# Altium project BW1098OBC_R1M0E1.PrjPcb
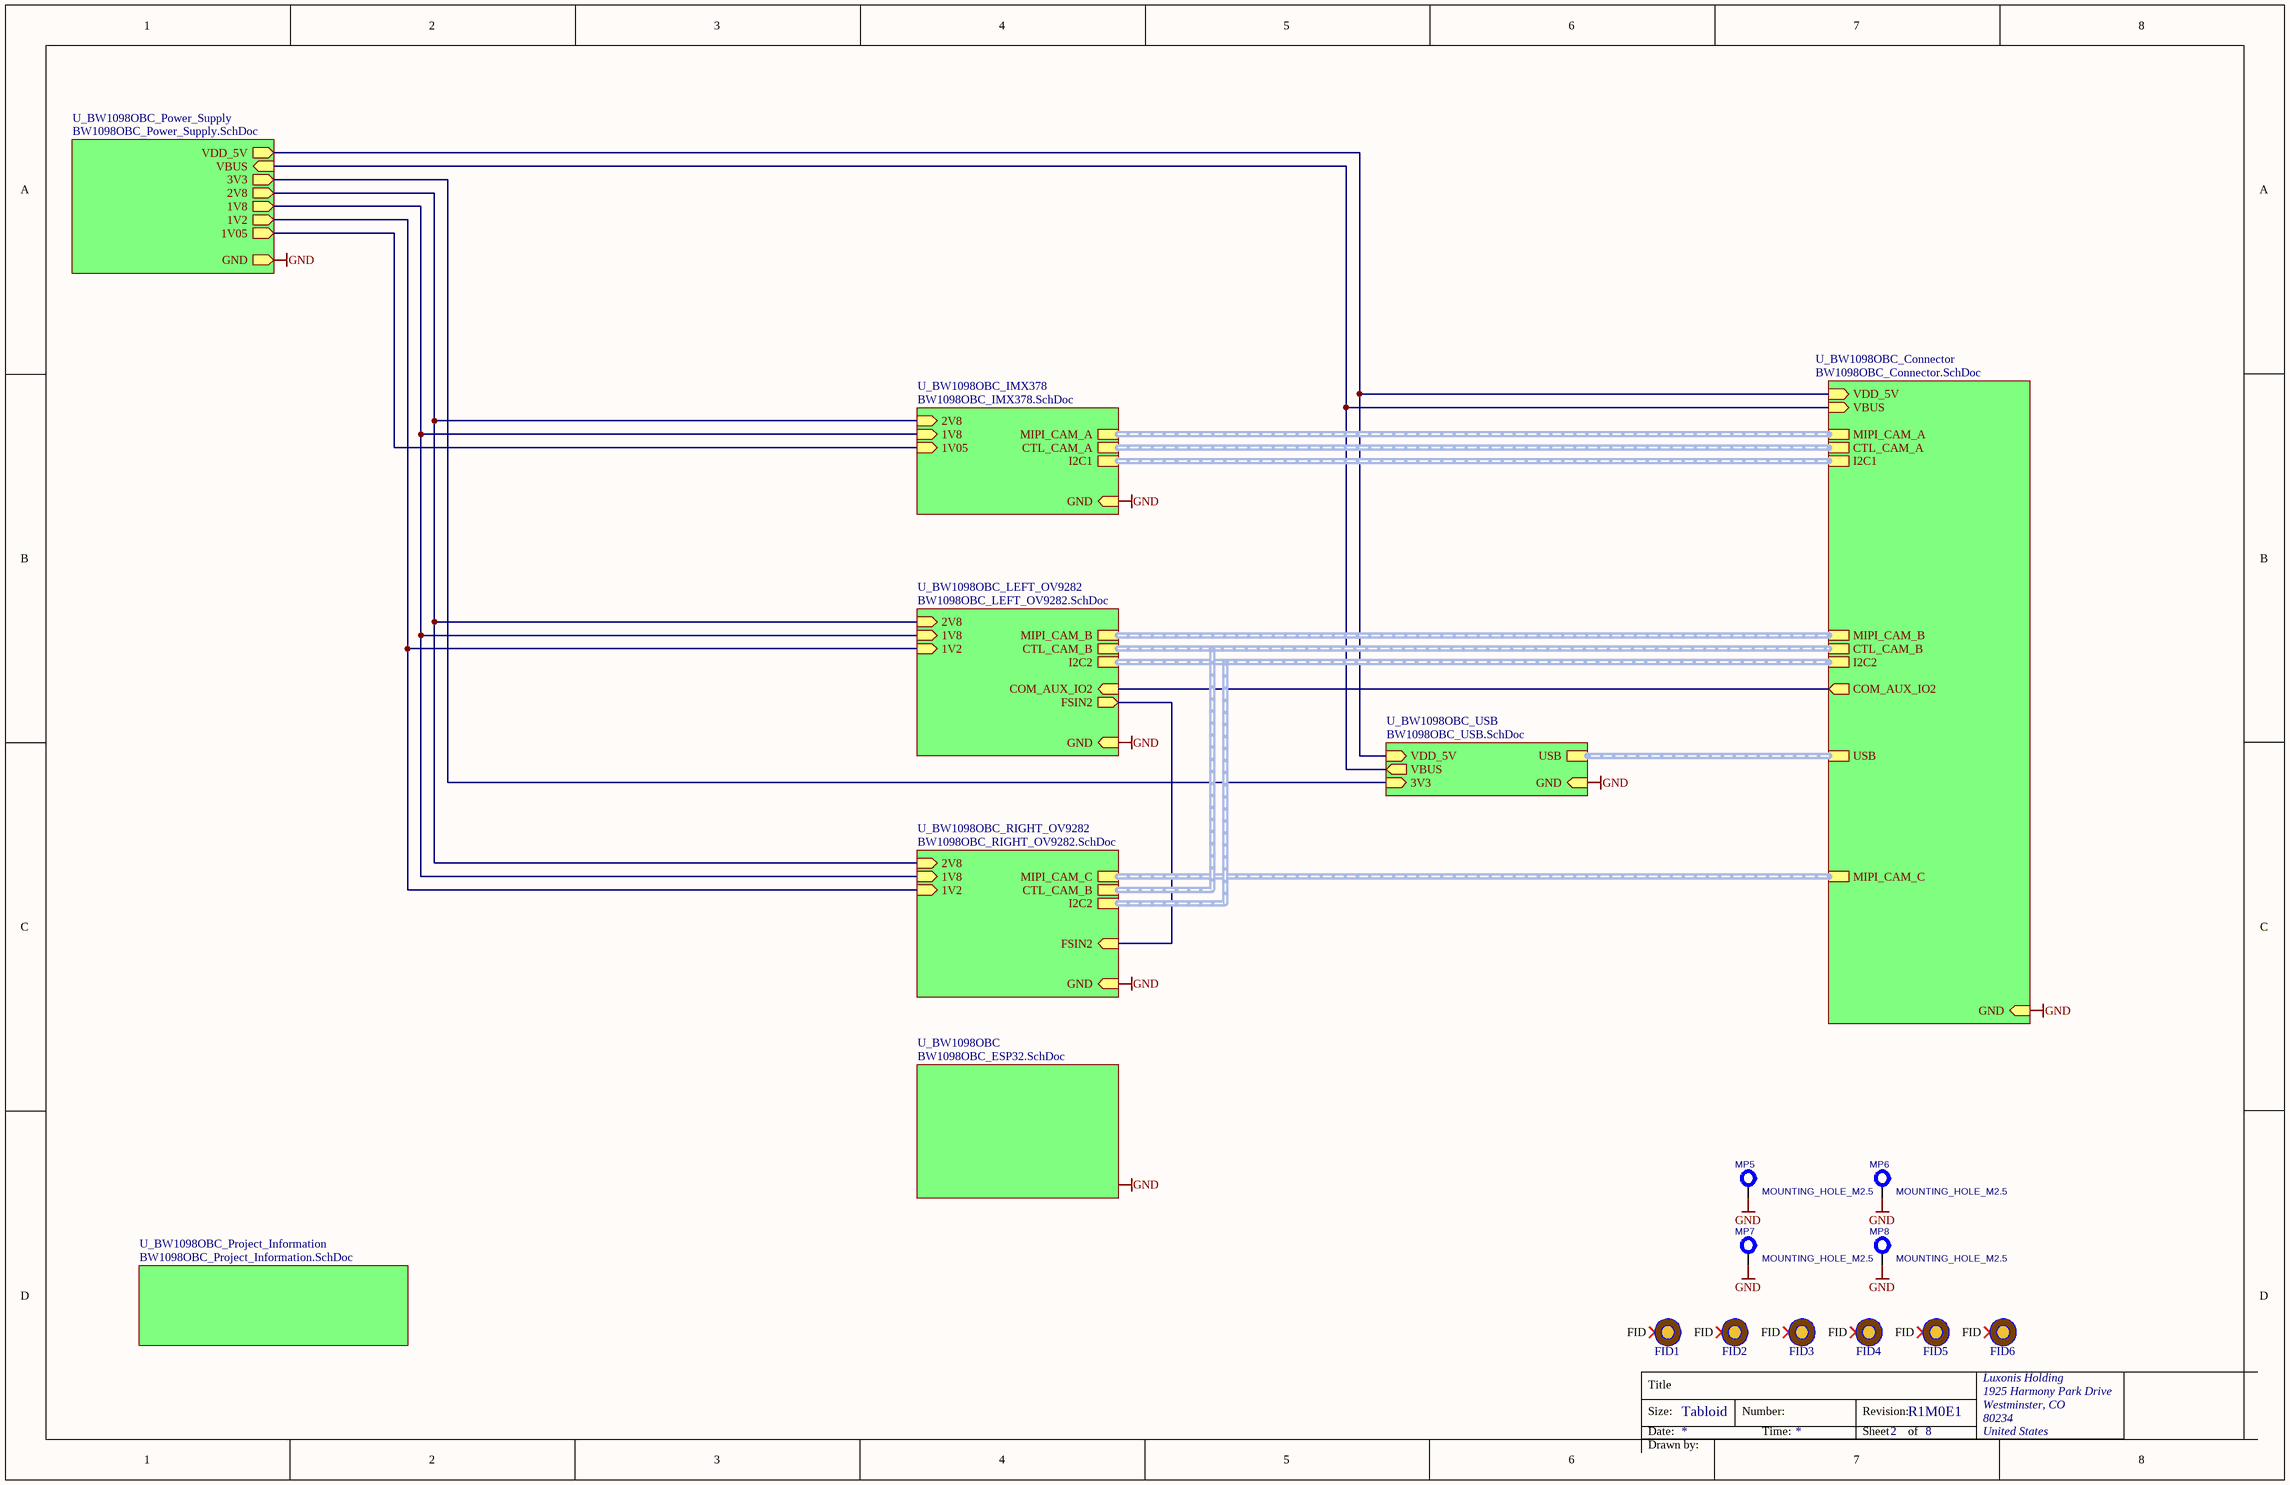
[diagram p0: BW1098OBC_TopLevel.SchDoc]
document_number: DXXXX; drawn_by: Brian Weinstein; project_title: BW1098OBC; revision: R1M0E1
2 sheets, 12 parts. Net scope: strictly hierarchical (ports join the sheet entries above them; power ports are local).
Board file: BW1098OBC.PcbDoc
Sheets:
  BW1098OBC_TopLevel.SchDoc
    U_BW1098OBC = BW1098OBC_ESP32.SchDoc

## Sheet BW1098OBC_TopLevel.SchDoc: =project_title
size Tabloid; CompanyName: Luxonis Holding; DrawnBy: Brian Weinstein; Organization: Luxonis Holding; Address1: 1925 Harmony Park Drive; Address2: Westminster, CO; Address3: 80234; Address4: United States; DocumentNumber: DXXXX; Revision: R1M0E1; SheetNumber: 2; SheetTotal: 8

### Parts
FID1  FIDUCIAL_ROUND_1MM  [FIDUCIAL_ROUND_1MM]  (value not drawn)  (no BOM)
FID2  FIDUCIAL_ROUND_1MM  [FIDUCIAL_ROUND_1MM]  (value not drawn)  (no BOM)
FID3  FIDUCIAL_ROUND_1MM  [FIDUCIAL_ROUND_1MM]  (value not drawn)  (no BOM)
FID4  FIDUCIAL_ROUND_1MM  [FIDUCIAL_ROUND_1MM]  (value not drawn)  (no BOM)
FID5  FIDUCIAL_ROUND_1MM  [FIDUCIAL_ROUND_1MM]  (value not drawn)  (no BOM)
FID6  FIDUCIAL_ROUND_1MM  [FIDUCIAL_ROUND_1MM]  (value not drawn)  (no BOM)
MP5  MOUNTING_HOLE_M2.5  [MOUNTING_HOLE_M2.5]  (no BOM)
MP6  MOUNTING_HOLE_M2.5  [MOUNTING_HOLE_M2.5]  (no BOM)
MP7  MOUNTING_HOLE_M2.5  [MOUNTING_HOLE_M2.5]  (no BOM)
MP8  MOUNTING_HOLE_M2.5  [MOUNTING_HOLE_M2.5]  (no BOM)

### Sub-sheets
U_BW1098OBC = BW1098OBC_ESP32.SchDoc: no entries
U_BW1098OBC_Connector = BW1098OBC_Connector.SchDoc (file not in this document): MIPI_CAM_B (harness MIPI_CAM_B), MIPI_CAM_A (harness MIPI_CAM_A), MIPI_CAM_C (harness MIPI_CAM_C), I2C2 (harness I2C2), I2C1 (harness I2C1), CTL_CAM_A (harness CTL_CAM_A), CTL_CAM_B (harness CTL_CAM_B), VDD_5V (in), GND (in), VBUS (in), USB (harness USB), COM_AUX_IO2 (out)
U_BW1098OBC_IMX378 = BW1098OBC_IMX378.SchDoc (file not in this document): 2V8 (in), 1V05 (in), I2C1 (harness I2C1), MIPI_CAM_A (harness MIPI_CAM_A), CTL_CAM_A (harness CTL_CAM_A), GND (in), 1V8 (in)
U_BW1098OBC_LEFT_OV9282 = BW1098OBC_LEFT_OV9282.SchDoc (file not in this document): I2C2 (harness I2C2), CTL_CAM_B (harness CTL_CAM_B), MIPI_CAM_B (harness MIPI_CAM_B), 1V2 (in), 2V8 (in), GND (in), 1V8 (in), FSIN2 (out), COM_AUX_IO2 (in)
U_BW1098OBC_Power_Supply = BW1098OBC_Power_Supply.SchDoc (file not in this document): 1V2 (out), 2V8 (out), GND (out), 1V8 (out), VDD_5V (out), VBUS (in), 3V3 (out), 1V05 (out)
U_BW1098OBC_Project_Information = BW1098OBC_Project_Information.SchDoc (file not in this document): no entries
U_BW1098OBC_RIGHT_OV9282 = BW1098OBC_RIGHT_OV9282.SchDoc (file not in this document): MIPI_CAM_C (harness MIPI_CAM_C), I2C2 (harness I2C2), 1V2 (in), 2V8 (in), GND (in), 1V8 (in), FSIN2 (in), CTL_CAM_B (harness CTL_CAM_B)
U_BW1098OBC_USB = BW1098OBC_USB.SchDoc (file not in this document): USB (harness USB), VBUS (out), GND (in), 3V3 (in), VDD_5V (in)

### Nets
GND: MP5.1 MP6.1 MP7.1 MP8.1 ; sheet U_BW1098OBC_Power_Supply/GND, sheet U_BW1098OBC_Connector/GND, sheet U_BW1098OBC_IMX378/GND, sheet U_BW1098OBC_RIGHT_OV9282/GND, sheet U_BW1098OBC_LEFT_OV9282/GND, sheet U_BW1098OBC_USB/GND
(unnamed): sheet U_BW1098OBC_Power_Supply/1V2, sheet U_BW1098OBC_RIGHT_OV9282/1V2, sheet U_BW1098OBC_LEFT_OV9282/1V2
(unnamed): sheet U_BW1098OBC_Power_Supply/2V8, sheet U_BW1098OBC_IMX378/2V8, sheet U_BW1098OBC_RIGHT_OV9282/2V8, sheet U_BW1098OBC_LEFT_OV9282/2V8
(unnamed): sheet U_BW1098OBC_Power_Supply/1V8, sheet U_BW1098OBC_IMX378/1V8, sheet U_BW1098OBC_RIGHT_OV9282/1V8, sheet U_BW1098OBC_LEFT_OV9282/1V8
(unnamed): sheet U_BW1098OBC_Power_Supply/VDD_5V, sheet U_BW1098OBC_Connector/VDD_5V, sheet U_BW1098OBC_USB/VDD_5V
(unnamed): sheet U_BW1098OBC_Power_Supply/VBUS, sheet U_BW1098OBC_Connector/VBUS, sheet U_BW1098OBC_USB/VBUS
(unnamed): sheet U_BW1098OBC_Power_Supply/3V3, sheet U_BW1098OBC_USB/3V3
(unnamed): sheet U_BW1098OBC_Power_Supply/1V05, sheet U_BW1098OBC_IMX378/1V05
(unnamed): sheet U_BW1098OBC_Connector/COM_AUX_IO2, sheet U_BW1098OBC_LEFT_OV9282/COM_AUX_IO2
(unnamed): sheet U_BW1098OBC_RIGHT_OV9282/FSIN2, sheet U_BW1098OBC_LEFT_OV9282/FSIN2

Not connected (* = marked no-connect by the designer): FID1 FID*; FID2 FID*; FID3 FID*; FID4 FID*; FID5 FID*; FID6 FID*

### Buses and harness runs
harness sheet U_BW1098OBC_Connector/CTL_CAM_A = sheet U_BW1098OBC_IMX378/CTL_CAM_A
harness sheet U_BW1098OBC_Connector/CTL_CAM_B = sheet U_BW1098OBC_LEFT_OV9282/CTL_CAM_B = sheet U_BW1098OBC_RIGHT_OV9282/CTL_CAM_B
harness sheet U_BW1098OBC_Connector/I2C1 = sheet U_BW1098OBC_IMX378/I2C1
harness sheet U_BW1098OBC_Connector/I2C2 = sheet U_BW1098OBC_LEFT_OV9282/I2C2 = sheet U_BW1098OBC_RIGHT_OV9282/I2C2
harness sheet U_BW1098OBC_Connector/MIPI_CAM_A = sheet U_BW1098OBC_IMX378/MIPI_CAM_A
harness sheet U_BW1098OBC_Connector/MIPI_CAM_B = sheet U_BW1098OBC_LEFT_OV9282/MIPI_CAM_B
harness sheet U_BW1098OBC_Connector/MIPI_CAM_C = sheet U_BW1098OBC_RIGHT_OV9282/MIPI_CAM_C
harness sheet U_BW1098OBC_Connector/USB = sheet U_BW1098OBC_USB/USB

### Notes on the sheet
- Labels drawn without touching a wire or pin: GND
- Title
- Size:
- Date:
- Tabloid
- Number:
- Time:
- Revision:
- Sheet
- of
- Drawn by:

### Library data of the parts
FID1-FID6 = FIDUCIAL: Fiducial with various available footprints
MP5-MP8 = MP_Mounting-Holes: =CurrentFootprint; B - Value: Not a Part; A - Level: 0

## Sheet BW1098OBC_ESP32.SchDoc
size A
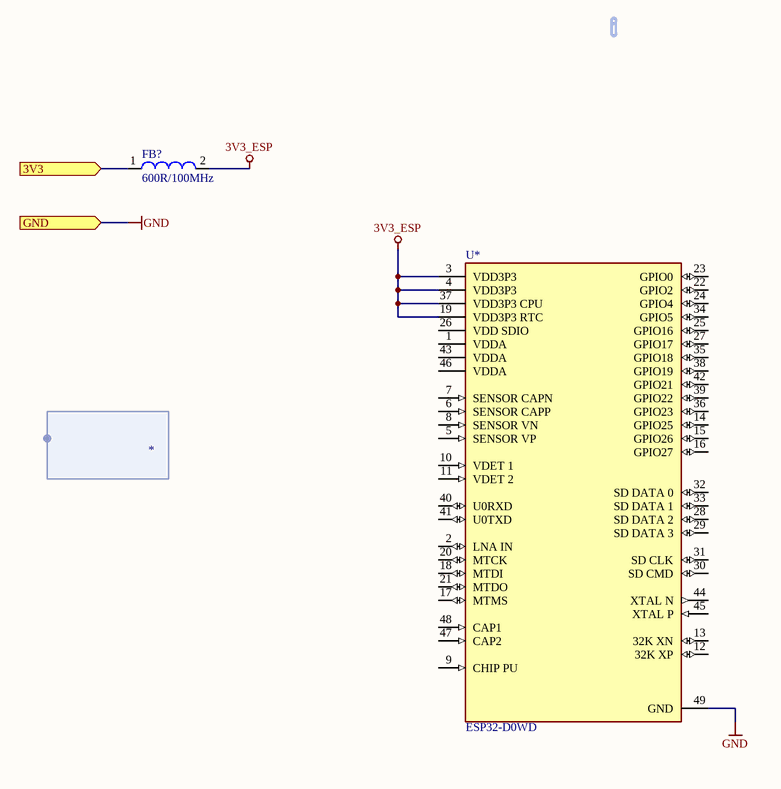
[diagram p1: BW1098OBC_ESP32.SchDoc]

### Parts
FB?  600R/100MHz  [2508056017Y2]
U*  ESP32-D0WD  [FP-ESP32-D0WD-IPC_A]

### Ports
3V3 (in), GND (in)

### Harnesses
*: 

### Nets
3V3_ESP: FB?.2 U*.3(VDD3P3) U*.4(VDD3P3) U*.19(VDD3P3_RTC) U*.37(VDD3P3_CPU)
GND: U*.49(GND) ; port GND
NetFB?_1: FB?.1 ; port 3V3

Not connected (* = marked no-connect by the designer): U* 1(VDDA) 2(LNA_IN) 5(SENSOR_VP) 6(SENSOR_CAPP) 7(SENSOR_CAPN) 8(SENSOR_VN) 9(CHIP_PU) 10(VDET_1) 11(VDET_2) 12(32K_XP) 13(32K_XN) 14(GPIO25) 15(GPIO26) 16(GPIO27) 17(MTMS) 18(MTDI) 20(MTCK) 21(MTDO) 22(GPIO2) 23(GPIO0) 24(GPIO4) 25(GPIO16) 26(VDD_SDIO) 27(GPIO17) 28(SD_DATA_2) 29(SD_DATA_3) 30(SD_CMD) 31(SD_CLK) 32(SD_DATA_0) 33(SD_DATA_1) 34(GPIO5) 35(GPIO18) 36(GPIO23) 38(GPIO19) 39(GPIO22) 40(U0RXD) 41(U0TXD) 42(GPIO21) 43(VDDA) 44(XTAL_N) 45(XTAL_P) 46(VDDA) 47(CAP2) 48(CAP1)

### Library data of the parts
FB? = 2508056017Y2: FERRITE BEAD, 0.1OHM, 2A, 0805, 600R/100MHz; Manufacturer 1: Fair-Rite; Impedance: 600R; Tolerance: 25%; Resistance: 350mR; DC Resistance (DCR): 100mR; Test Frequency: 100MHz; Supplier 1: Digi-Key; Manufacturer Part Number 1: 2508056017Y2; Stock 1: 100491; Pricing 1: 1=0.10000, 10=0.07900, 25=0.07120, 50=0.05240, 100=0.04520, 250=0.03568, 500=0.03014, 1000=0.02538 (USD); RoHS: Yes; Case/Package: 0805; Number of Pins: 2; Case Code (Metric): 2012; Case Code (Imperial): 0805; Min Operating Temperature: -55°C; Max Operating Temperature: 125°C; Package Quantity: 4000; Packaging: Tape and Reel; Max DC Current: 2A; Termination: SMD/SMT; Military Standard: Not; DC Current: 2A; Current Rating: 2A; Frequency: 100MHz; Length: 2mm; Height: 0.9mm; Width: 1.25mm; Depth: 1.25mm; Radiation Hardening: No; REACH SVHC: No SVHC; ComponentLink1URL: https://datasheet.ciiva.com/3854/3802508056017y2-3854245.pdf?src-supplier=Arrow; ComponentLink1Description: https://datasheet.ciiva.com/3854/3802508056017y2-3854245.pdf?src-supplier=Arrow; ComponentLink2URL: https://datasheet.ciiva.com/22735/652149-22735047.pdf?src-supplier=Element14; ComponentLink2Description: https://datasheet.ciiva.com/22735/652149-22735047.pdf?src-supplier=Element14; ComponentLink3URL: https://datasheet.ciiva.com/1127/26143-1127514.pdf?src-supplier=Farnell; ComponentLink3Description: https://datasheet.ciiva.com/1127/26143-1127514.pdf?src-supplier=Farnell; ComponentLink4URL: https://datasheet.ciiva.com/18090/getdatasheetpartid-212640-18090187.pdf?src-supplier=Verical; ComponentLink4Description: https://datasheet.ciiva.com/18090/getdatasheetpartid-212640-18090187.pdf?src-supplier=Verical; ComponentLink5URL: https://datasheet.ciiva.com/7620/26143-7620140.pdf?src-supplier=Element14; ComponentLink5Description: https://datasheet.ciiva.com/7620/26143-7620140.pdf?src-supplier=Element14; Supplier Part Number 1: 1934-1487-1-ND
U* = ESP32-D0WD: SMD IC ESP32-D0WD, Dual Core Mcu, Wifi & Bluetooth Combo, QFN48-PIN, 5*5MM; Manufacturer: Espressif Systems; Frequency: 2.4GHz; Data Rate: 150Mbps; Interface: I2C,SPI,UART; Sensitivity: -98dBm; Memory Size: 520KB; Current - Receiving: 100mA; Current - Transmitting: 240mA; Number of GPIO: 34; Supplier 1: Digi-Key; Manufacturer Part Number: ESP32-D0WD; RoHS: No; Stock 1: 6655; Pricing 1: 1=3.00000 (USD); Min Operating Temperature: -40°C; Max Operating Temperature: 125°C; Packaging: Tape and Reel; ComponentLink1URL: http://espressif.com/sites/default/files/documentation/esp32_datasheet_en.pdf?src-supplier=Digi-Key; ComponentLink1Description: http://espressif.com/sites/default/files/documentation/esp32_datasheet_en.pdf?src-supplier=Digi-Key; Supplier Part Number 1: 1904-1003-1-ND

## Assembly variants
Production: not fitted C37 D1 J4 J5 J6 J? MISC1 R6 R18 R19 R22 R24 R25 R26 R27 R29 R30 U7